# EAGLE design Differential driver (EAGLE 7.6.0)
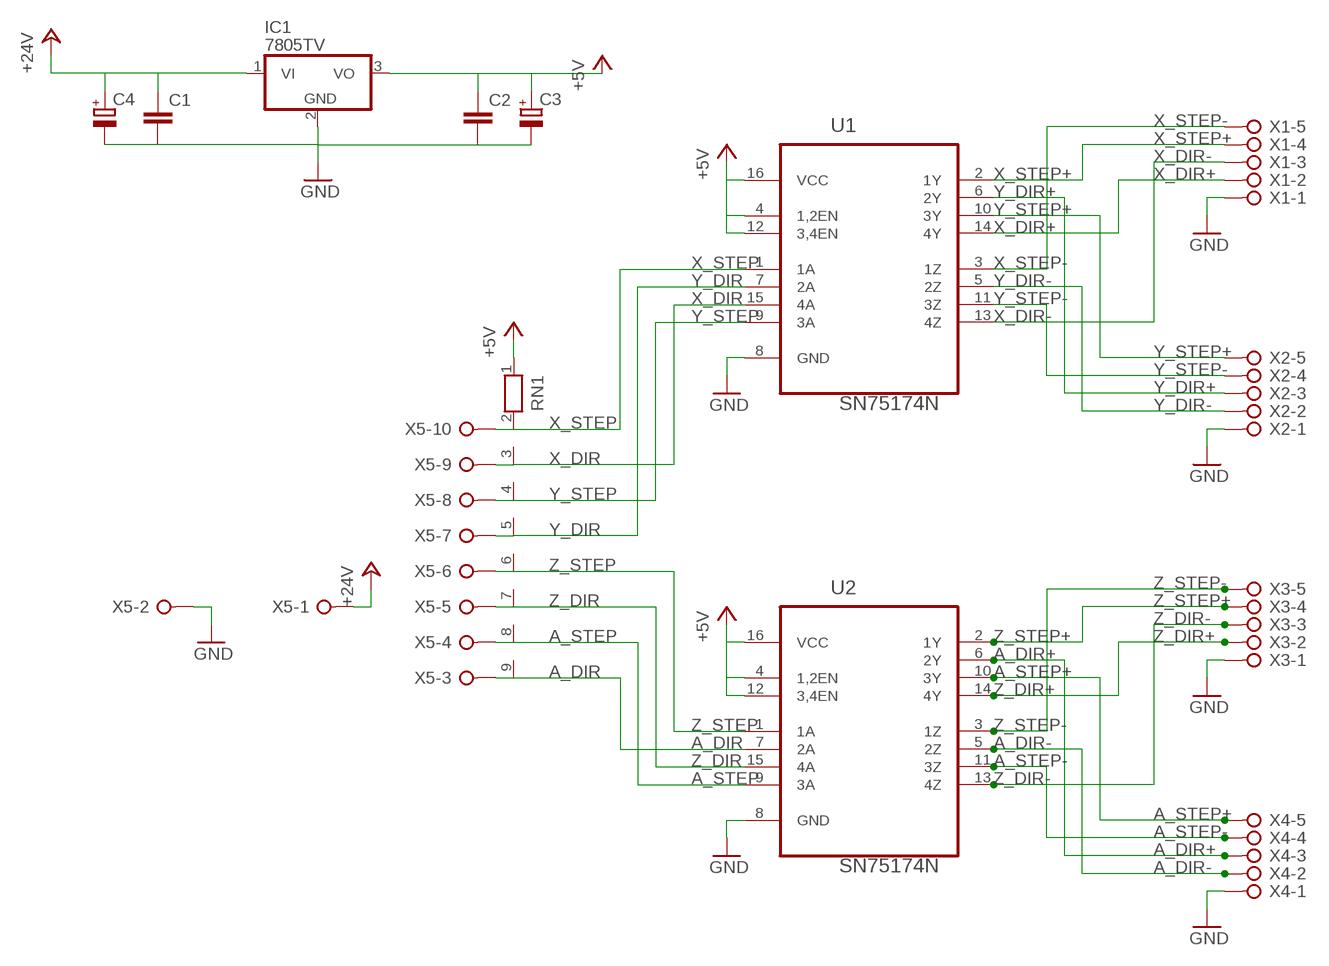
[diagram p0: schematic, sheet 1]

## Parts
C1  C-EU025-025X050  [C025-025X050]
C2  C-EU025-025X050  [C025-025X050]
C3  CPOL-EUE2.5-5  [E2,5-5]
C4  CPOL-EUE2.5-5  [E2,5-5]
IC1  7805TV  [TO220V]
RN1  RN08  [RN-9]
U1  SN75174N  [DIP254P762X508-16]
U2  SN75174N  [DIP254P762X508-16]
X1  W237-05P  [W237-5P]
X2  W237-05P  [W237-5P]
X3  W237-05P  [W237-5P]
X4  W237-05P  [W237-5P]
X5  W237-10P  [W237-10P]

## Nets
+5V: C2.1 C3.+ IC1.3(VO) RN1.1 U1.4(1,2EN) U1.12(3,4EN) U1.16(VCC) U2.4(1,2EN) U2.12(3,4EN) U2.16(VCC)
+24V: C1.1 C4.+ IC1.1(VI) X5.1
A_DIR: RN1.9 U2.7(2A) X5.3
A_DIR+: U2.6(2Y) X4.3
A_DIR-: U2.5(2Z) X4.2
A_STEP: RN1.8 U2.9(3A) X5.4
A_STEP+: U2.10(3Y) X4.5
A_STEP-: U2.11(3Z) X4.4
GND: C1.2 C2.2 C3.- C4.- IC1.2(GND) U1.8(GND) U2.8(GND) X1.1 X2.1 X3.1 X4.1 X5.2
X_DIR: RN1.3 U1.15(4A) X5.9
X_DIR+: U1.14(4Y) X1.2
X_DIR-: U1.13(4Z) X1.3
X_STEP: RN1.2 U1.1(1A) X5.10
X_STEP+: U1.2(1Y) X1.4
X_STEP-: U1.3(1Z) X1.5
Y_DIR: RN1.5 U1.7(2A) X5.7
Y_DIR+: U1.6(2Y) X2.3
Y_DIR-: U1.5(2Z) X2.2
Y_STEP: RN1.4 U1.9(3A) X5.8
Y_STEP+: U1.10(3Y) X2.5
Y_STEP-: U1.11(3Z) X2.4
Z_DIR: RN1.7 U2.15(4A) X5.5
Z_DIR+: U2.14(4Y) X3.2
Z_DIR-: U2.13(4Z) X3.3
Z_STEP: RN1.6 U2.1(1A) X5.6
Z_STEP+: U2.2(1Y) X3.4
Z_STEP-: U2.3(1Z) X3.5

## Library data of the parts
C1 C2 = rcl:C-EU: CAPACITOR, European symbol
C3 C4 = rcl:CPOL-EU: POLARIZED CAPACITOR, European symbol
IC1 = linear:78*: Positive VOLTAGE REGULATOR Source: http://cache.national.com/ds/LM/LM78L05.pdf http://www.fairchildsemi.com/ds/LM/LM7805.pdf
RN1 = resistor-net:RN08: RESISTOR NETWORK; OC_FARNELL: unknown; OC_NEWARK: unknown
U1 U2 = Texas Instruments_By_element14_Batch_1:SN75174N: QUADRUPLE DIFFERENTIAL LINE DRIVER; MPN: SN75174N; OC_FARNELL: 1106026; OC_NEWARK: 60K6927; PACKAGE: PDIP-16; SUPPLIER: Texas Instruments
X1-X4 = con-wago-508:W237-05P: WAGO SREW CLAMP; OC_FARNELL: unknown; OC_NEWARK: unknown
X5 = con-wago-508:W237-10P: WAGO SREW CLAMP; OC_FARNELL: unknown; OC_NEWARK: unknown

## Board
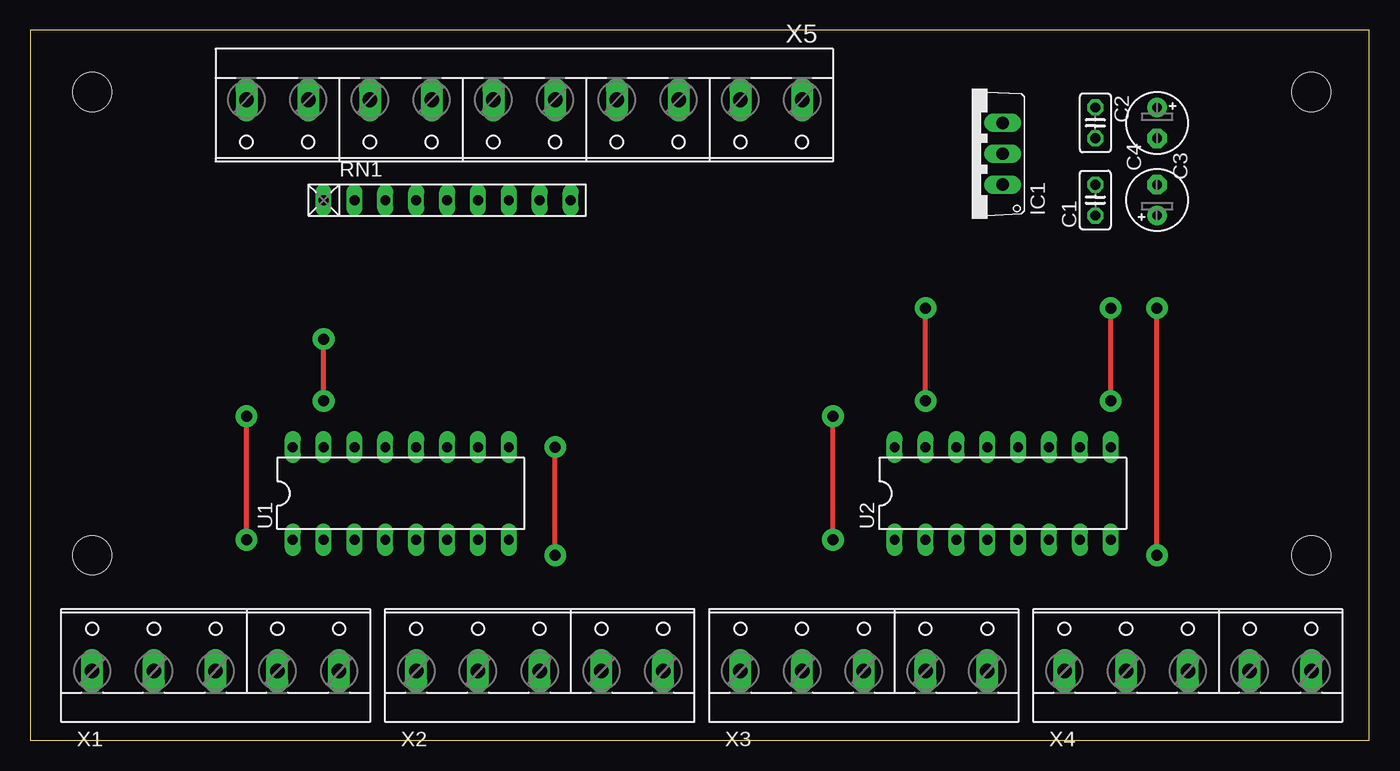
[diagram p1: board, top side]
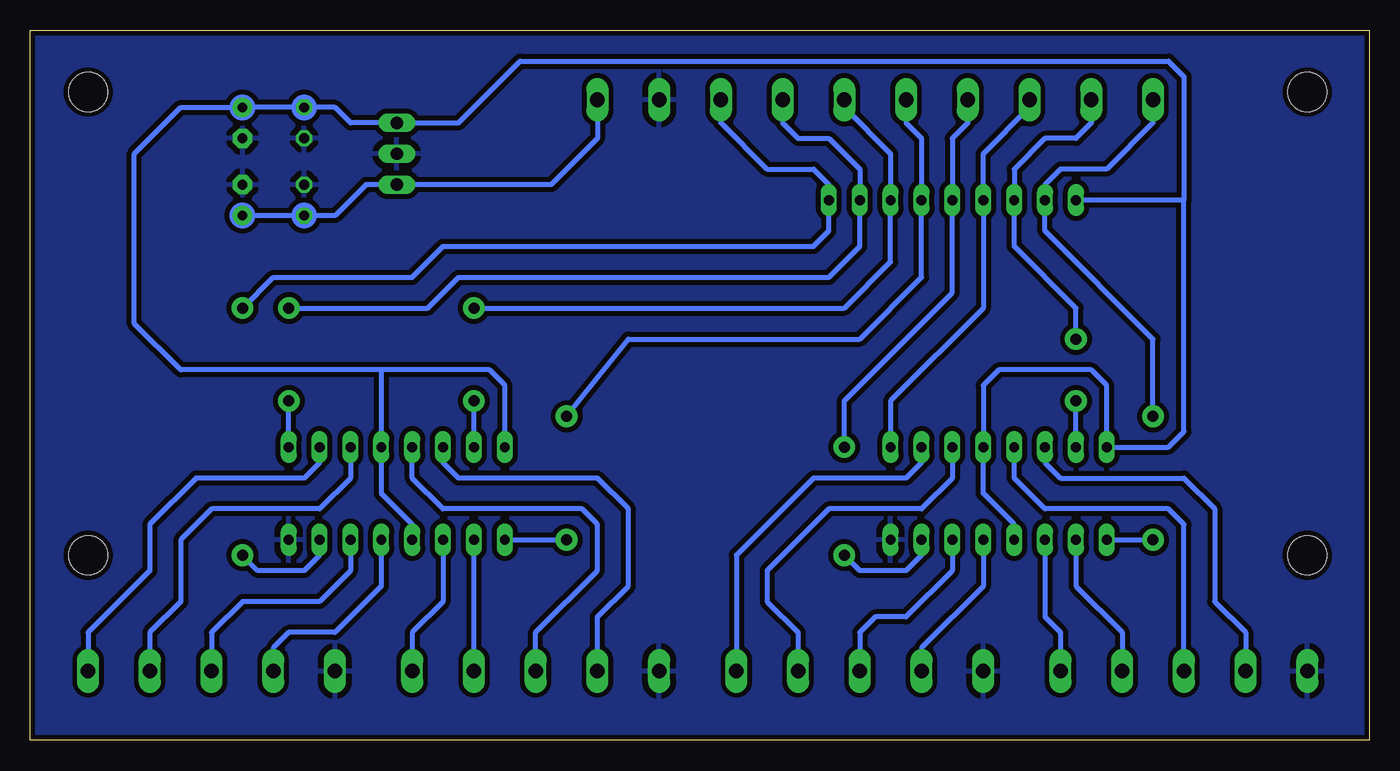
[diagram p2: board, bottom side, seen from below]

Size 110.16 x 58.41 mm. Coordinates in mm from the lower left corner, seen from the top.
Outline: 0,0 110.16,0 110.16,58.41 0,58.41 0,0
Copper layers (1*16): Top 0.035mm / dielectric 1.5mm / Bottom 0.035mm
Design rules "default *": minimum track width 20mil, minimum drill 24mil, track to track 16mil, track to pad 16mil, pad to pad 20mil, via to via 20mil, smd to smd 8mil, copper to edge 16mil, drill to drill 8mil, minimum pad ring 10mil, minimum via ring 8mil, stop-mask expansion 4mil, vias tented up to drill 0mil, thermal gap 20mil
Holes 3.2 mm at 5.08,15.24 105.41,15.24 105.41,53.34 5.08,53.34

### Footprints (pad centres in the part's own frame; a part is rotated, then mirrored left to right if it is on the bottom)
C025-025X050 = drill 0.813 octagon: 1 -1.27,0; 2 1.27,0
E2,5-5 = drill 0.813 pad 1.6: + -1.27,0 | drill 0.813 pad 1.6 octagon: - 1.27,0
TO220V = drill 1.016 long: 1 -2.54,-2.54; 2 0,-2.54; 3 2.54,-2.54
RN-9 = drill 0.813 long: 1 -10.16,0; 2 -7.62,0; 3 -5.08,0; 4 -2.54,0; 5 0,0; 6 2.54,0; 7 5.08,0; 8 7.62,0; 9 10.16,0
DIL16 = drill 0.813 long: 1 -8.89,-3.81; 2 -6.35,-3.81; 3 -3.81,-3.81; 4 -1.27,-3.81; 5 1.27,-3.81; 6 3.81,-3.81; 7 6.35,-3.81; 8 8.89,-3.81; 9 8.89,3.81; 10 6.35,3.81; 11 3.81,3.81; 12 1.27,3.81; 13 -1.27,3.81; 14 -3.81,3.81; 15 -6.35,3.81; 16 -8.89,3.81
W237-5P = drill 1.194 long: 1 -10.16,-0.635; 2 -5.08,-0.635; 3 0,-0.635; 4 5.08,-0.635; 5 10.16,-0.635
W237-10P = drill 1.194 long: 1 -22.86,-0.635; 2 -17.78,-0.635; 3 -12.7,-0.635; 4 -7.62,-0.635; 5 -2.54,-0.635; 6 2.54,-0.635; 7 7.62,-0.635; 8 12.7,-0.635; 9 17.78,-0.635; 10 22.86,-0.635

### Placement (x,y rotation side)
C1  87.63,44.45 90 top
C2  87.63,50.8 270 top
C3  92.71,50.8 270 top
C4  92.71,44.45 90 top
IC1  77.47,48.26 90 top
RN1  34.29,44.45 0 top
U1  SN75174N  [DIL16]  30.48,20.32 0 top
U2  SN75174N  [DIL16]  80.01,20.32 0 top
X1  15.24,6.35 0 top
X2  41.91,6.35 0 top
X3  68.58,6.35 0 top
X4  95.25,6.35 0 top
X5  40.64,52.07 180 top

### Tracks (layer width: path | path; a pad name or v marks a point on that pad's centre or on a via)
+5V
  Bottom 0.406: U1.4 29.21,17.78 31.75,20.32 U1.12 31.75,29.21 30.48,30.48 22.86,30.48 21.59,29.21 U1.16 16.51,24.13 15.24,25.4 15.24,44.45 | 15.24,44.45 RN1.1 | 15.24,44.45 15.24,54.61 16.51,55.88 69.85,55.88 74.93,50.8 IC1.3 83.82,50.8 85.09,52.07 C2.1 C3.+ 97.79,52.07 101.6,48.26 101.6,34.29 97.79,30.48 81.28,30.48 | U2.4 78.74,17.78 81.28,20.32 U2.12 81.28,30.48 | U2.16 71.12,29.21 72.39,30.48 81.28,30.48
+24V
  Bottom 0.406: X5.1 63.5,49.53 67.31,45.72 IC1.1 82.55,45.72 85.09,43.18 C1.1 C4.+
A_DIR  (via drill 0.8 pad 1.78, 0.9 pad 1.68)
  Top 0.406: v92.71,15.24 v92.71,35.56
  Bottom 0.406: U2.7 86.36,15.24 87.63,13.97 91.44,13.97 v92.71,15.24 | v92.71,35.56 90.17,38.1 78.74,38.1 76.2,40.64 45.72,40.64 44.45,41.91 RN1.9 44.45,45.72 45.72,46.99 49.53,46.99 53.34,50.8 X5.3
A_DIR+
  Bottom 0.406: U2.6 83.82,13.97 86.36,11.43 92.71,11.43 95.25,8.89 X4.3
A_DIR-
  Bottom 0.406: U2.5 81.28,12.7 85.09,8.89 88.9,8.89 90.17,7.62 X4.2
A_STEP  (via drill 0.8 pad 1.78, 0.9 pad 1.78)
  Top 0.406: v88.9,27.94 v88.9,35.56
  Bottom 0.406: v88.9,35.56 77.47,35.56 74.93,38.1 44.45,38.1 41.91,40.64 RN1.8 41.91,46.99 44.45,49.53 46.99,49.53 48.26,50.8 X5.4 | U2.9 v88.9,27.94
A_STEP+
  Bottom 0.406: U2.10 86.36,22.86 87.63,21.59 96.52,21.59 100.33,17.78 100.33,13.97 105.41,8.89 X4.5
A_STEP-
  Bottom 0.406: U2.11 83.82,21.59 86.36,19.05 95.25,19.05 97.79,16.51 97.79,11.43 100.33,8.89 X4.4
GND
  pour Bottom: 0,58.42 110.49,58.42 110.49,0 0,0
X_DIR  (via drill 0.8 pad 1.78, 0.9 pad 1.68)
  Top 0.406: v24.13,27.94 v24.13,33.02
  Bottom 0.406: U1.15 v24.13,27.94 | v24.13,33.02 24.13,35.56 29.21,40.64 RN1.3 29.21,46.99 26.67,49.53 24.13,49.53 22.86,50.8 X5.9
X_DIR+
  Bottom 0.406: U1.14 26.67,22.86 25.4,21.59 15.24,21.59 12.7,19.05 12.7,11.43 10.16,8.89 X1.2
X_DIR-
  Bottom 0.406: U1.13 29.21,21.59 26.67,19.05 16.51,19.05 15.24,17.78 X1.3
X_STEP  (via drill 0.8 pad 1.78, 0.9 pad 1.68)
  Top 0.406: v17.78,16.51 v17.78,26.67
  Bottom 0.406: U1.1 v17.78,16.51 | v17.78,26.67 17.78,33.02 26.67,41.91 RN1.2 26.67,45.72 25.4,46.99 21.59,46.99 17.78,50.8 X5.10
X_STEP+
  Bottom 0.406: U1.2 24.13,12.7 20.32,8.89 X1.4
X_STEP-
  Bottom 0.406: U1.3 26.67,10.16 25.4,8.89 X1.5
Y_DIR  (via drill 0.8 pad 1.78, 0.9 pad 1.68)
  Top 0.406: v43.18,15.24 v43.18,24.13
  Bottom 0.406: X5.7 33.02,50.8 34.29,49.53 RN1.5 34.29,36.83 43.18,27.94 v43.18,24.13 | U1.7 36.83,15.24 38.1,13.97 41.91,13.97 v43.18,15.24
Y_DIR+
  Bottom 0.406: U1.6 34.29,13.97 38.1,10.16 40.64,10.16 41.91,8.89 X2.3
Y_DIR-
  Bottom 0.406: U1.5 31.75,12.7 36.83,7.62 X2.2
Y_STEP
  Bottom 0.406: X5.8 27.94,52.07 31.75,48.26 RN1.4 31.75,35.56 39.37,27.94 U1.9
Y_STEP+
  Bottom 0.406: U1.10 36.83,22.86 38.1,21.59 45.72,21.59 52.07,15.24 X2.5
Y_STEP-
  Bottom 0.406: U1.11 34.29,21.59 36.83,19.05 44.45,19.05 49.53,13.97 49.53,11.43 46.99,8.89 X2.4
Z_DIR  (via drill 0.8 pad 1.78, 0.9 pad 1.78)
  Top 0.406: v73.66,27.94 v73.66,35.56
  Bottom 0.406: X5.5 43.18,52.07 39.37,48.26 RN1.7 39.37,39.37 43.18,35.56 v73.66,35.56 | U2.15 v73.66,27.94
Z_DIR+
  Bottom 0.406: X3.2 63.5,10.16 60.96,12.7 60.96,19.05 63.5,21.59 74.93,21.59 76.2,22.86 U2.14
Z_DIR-
  Bottom 0.406: X3.3 68.58,8.89 63.5,13.97 63.5,17.78 64.77,19.05 76.2,19.05 78.74,21.59 U2.13
Z_STEP  (via drill 0.8 pad 1.78, 0.9 pad 1.68)
  Top 0.406: v66.04,16.51 v66.04,26.67
  Bottom 0.406: X5.6 38.1,50.8 36.83,49.53 RN1.6 36.83,38.1 41.91,33.02 60.96,33.02 v66.04,26.67 | U2.1 v66.04,16.51
Z_STEP+
  Bottom 0.406: X3.4 U2.2
Z_STEP-
  Bottom 0.406: U2.3 76.2,11.43 78.74,8.89 X3.5
(copper drawn outside any net)
  shapes: Bottom circle x4